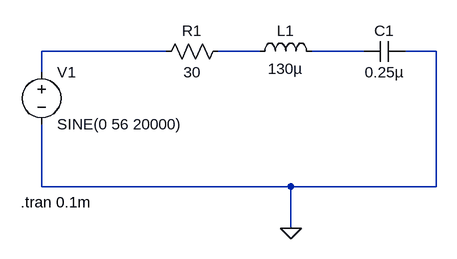
[diagram p0: schematic RLC.asc]
RLC.asc, the LTspice schematic file:
Version 4
SHEET 1 880 680
WIRE 64 96 -128 96
WIRE 208 96 144 96
WIRE 368 96 288 96
WIRE 480 96 432 96
WIRE -128 128 -128 96
WIRE -128 304 -128 208
WIRE 256 304 -128 304
WIRE 480 304 480 96
WIRE 480 304 256 304
WIRE 256 368 256 304
FLAG 256 368 0
SYMBOL voltage -128 112 R0
WINDOW 123 0 0 Left 0
WINDOW 39 0 0 Left 0
SYMATTR InstName V1
SYMATTR Value SINE(0 56 20000)
SYMBOL res 160 80 R90
WINDOW 0 0 56 VBottom 2
WINDOW 3 32 56 VTop 2
SYMATTR InstName R1
SYMATTR Value 30
SYMBOL ind 192 112 R270
WINDOW 0 32 56 VTop 2
WINDOW 3 5 56 VBottom 2
SYMATTR InstName L1
SYMATTR Value 130µ
SYMBOL cap 368 112 R270
WINDOW 0 32 32 VTop 2
WINDOW 3 0 32 VBottom 2
SYMATTR InstName C1
SYMATTR Value 0.25µ
TEXT -160 328 Left 2 !.tran 0.1m

The netlist it stands for:
* RLC.asc
V1 N001 0 SINE(0 56 20000)
R1 N002 N001 30
L1 N002 N003 130µ
C1 N003 0 0.25µ
.tran 0.1m
.backanno
.end